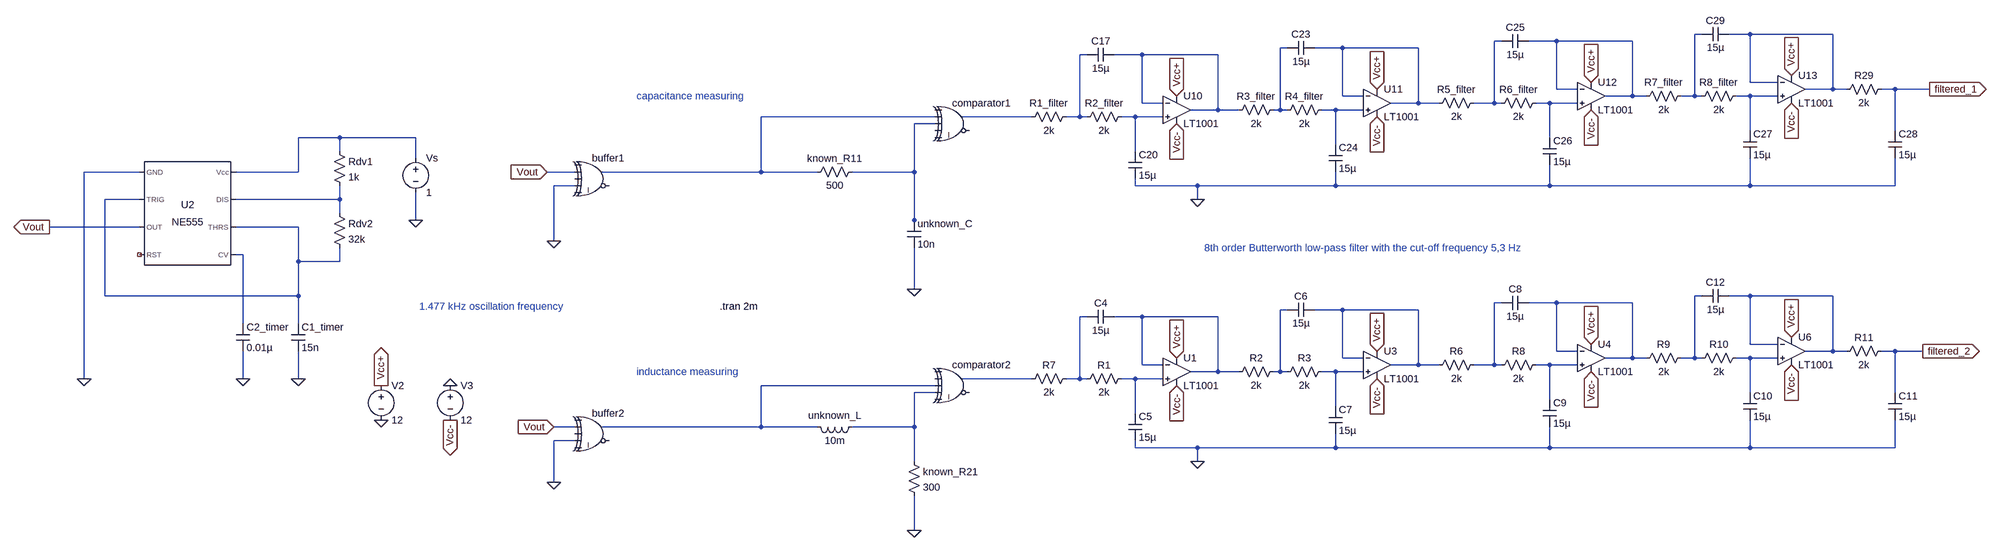
[diagram p0: schematic devre.asc]
devre.asc, the LTspice schematic file:
Version 4
SHEET 1 8244 868
WIRE 5776 -608 5760 -608
WIRE 5888 -608 5840 -608
WIRE 6080 -608 5888 -608
WIRE 5312 -592 5296 -592
WIRE 5440 -592 5376 -592
WIRE 5616 -592 5440 -592
WIRE 4816 -576 4800 -576
WIRE 4944 -576 4880 -576
WIRE 5120 -576 4944 -576
WIRE 4352 -560 4336 -560
WIRE 4480 -560 4416 -560
WIRE 4656 -560 4480 -560
WIRE 5888 -496 5888 -608
WIRE 5952 -496 5888 -496
WIRE 5440 -480 5440 -592
WIRE 5488 -480 5440 -480
WIRE 6080 -480 6080 -608
WIRE 6080 -480 6016 -480
WIRE 6112 -480 6080 -480
WIRE 6224 -480 6192 -480
WIRE 6304 -480 6224 -480
WIRE 4944 -464 4944 -576
WIRE 4992 -464 4944 -464
WIRE 5616 -464 5616 -592
WIRE 5616 -464 5552 -464
WIRE 5648 -464 5616 -464
WIRE 5760 -464 5760 -608
WIRE 5760 -464 5728 -464
WIRE 5776 -464 5760 -464
WIRE 5888 -464 5856 -464
WIRE 5952 -464 5888 -464
WIRE 4480 -448 4480 -560
WIRE 4528 -448 4480 -448
WIRE 5120 -448 5120 -576
WIRE 5120 -448 5056 -448
WIRE 5168 -448 5120 -448
WIRE 5296 -448 5296 -592
WIRE 5296 -448 5248 -448
WIRE 5312 -448 5296 -448
WIRE 5424 -448 5392 -448
WIRE 5488 -448 5424 -448
WIRE 4656 -432 4656 -560
WIRE 4656 -432 4592 -432
WIRE 4704 -432 4656 -432
WIRE 4800 -432 4800 -576
WIRE 4800 -432 4784 -432
WIRE 4816 -432 4800 -432
WIRE 4928 -432 4896 -432
WIRE 4992 -432 4928 -432
WIRE 4000 -416 3584 -416
WIRE 4224 -416 4064 -416
WIRE 4336 -416 4336 -560
WIRE 4336 -416 4304 -416
WIRE 4352 -416 4336 -416
WIRE 4464 -416 4432 -416
WIRE 4528 -416 4464 -416
WIRE 4000 -400 3952 -400
WIRE 5888 -384 5888 -464
WIRE 6224 -384 6224 -480
WIRE 2608 -368 2512 -368
WIRE 2784 -368 2608 -368
WIRE 5424 -368 5424 -448
WIRE 4928 -352 4928 -432
WIRE 2608 -336 2608 -368
WIRE 4464 -336 4464 -416
WIRE 2784 -320 2784 -368
WIRE 2144 -288 2016 -288
WIRE 2512 -288 2512 -368
WIRE 2512 -288 2368 -288
WIRE 3152 -288 3088 -288
WIRE 3584 -288 3584 -416
WIRE 3584 -288 3216 -288
WIRE 3728 -288 3584 -288
WIRE 3952 -288 3952 -400
WIRE 3952 -288 3808 -288
WIRE 3152 -256 3104 -256
WIRE 4464 -256 4464 -272
WIRE 4608 -256 4464 -256
WIRE 4928 -256 4928 -288
WIRE 4928 -256 4608 -256
WIRE 5424 -256 5424 -304
WIRE 5424 -256 4928 -256
WIRE 5888 -256 5888 -320
WIRE 5888 -256 5424 -256
WIRE 6224 -256 6224 -320
WIRE 6224 -256 5888 -256
WIRE 2144 -224 2064 -224
WIRE 2608 -224 2608 -256
WIRE 2608 -224 2368 -224
WIRE 4608 -224 4608 -256
WIRE 2608 -192 2608 -224
WIRE 2784 -176 2784 -240
WIRE 3952 -176 3952 -288
WIRE 2144 -160 1936 -160
WIRE 2512 -160 2368 -160
WIRE 3952 -160 3952 -176
WIRE 3104 -128 3104 -256
WIRE 2384 -96 2368 -96
WIRE 2512 -80 2512 -160
WIRE 2608 -80 2608 -112
WIRE 2608 -80 2512 -80
WIRE 3952 -16 3952 -112
WIRE 2064 0 2064 -224
WIRE 2512 0 2512 -80
WIRE 2512 0 2064 0
WIRE 5776 0 5760 0
WIRE 5888 0 5840 0
WIRE 6080 0 5888 0
WIRE 5312 16 5296 16
WIRE 5440 16 5376 16
WIRE 5616 16 5440 16
WIRE 4816 32 4800 32
WIRE 4944 32 4880 32
WIRE 5120 32 4944 32
WIRE 4352 48 4336 48
WIRE 4480 48 4416 48
WIRE 4656 48 4480 48
WIRE 2384 64 2384 -96
WIRE 2512 64 2512 0
WIRE 5888 112 5888 0
WIRE 5952 112 5888 112
WIRE 5440 128 5440 16
WIRE 5488 128 5440 128
WIRE 6080 128 6080 0
WIRE 6080 128 6016 128
WIRE 6112 128 6080 128
WIRE 6224 128 6192 128
WIRE 6288 128 6224 128
WIRE 4944 144 4944 32
WIRE 4992 144 4944 144
WIRE 5616 144 5616 16
WIRE 5616 144 5552 144
WIRE 5648 144 5616 144
WIRE 5760 144 5760 0
WIRE 5760 144 5728 144
WIRE 5776 144 5760 144
WIRE 5888 144 5856 144
WIRE 5952 144 5888 144
WIRE 4480 160 4480 48
WIRE 4528 160 4480 160
WIRE 5120 160 5120 32
WIRE 5120 160 5056 160
WIRE 5168 160 5120 160
WIRE 5296 160 5296 16
WIRE 5296 160 5248 160
WIRE 5312 160 5296 160
WIRE 5424 160 5392 160
WIRE 5488 160 5424 160
WIRE 4656 176 4656 48
WIRE 4656 176 4592 176
WIRE 4704 176 4656 176
WIRE 4800 176 4800 32
WIRE 4800 176 4784 176
WIRE 4816 176 4800 176
WIRE 4928 176 4896 176
WIRE 4992 176 4928 176
WIRE 2016 192 2016 -288
WIRE 2384 192 2384 128
WIRE 2512 192 2512 128
WIRE 4224 192 4064 192
WIRE 4336 192 4336 48
WIRE 4336 192 4304 192
WIRE 4352 192 4336 192
WIRE 4464 192 4432 192
WIRE 4528 192 4464 192
WIRE 4000 208 3584 208
WIRE 4000 224 3952 224
WIRE 5888 224 5888 144
WIRE 6224 224 6224 128
WIRE 5424 240 5424 160
WIRE 4928 256 4928 176
WIRE 4464 272 4464 192
WIRE 3152 304 3104 304
WIRE 3584 304 3584 208
WIRE 3584 304 3216 304
WIRE 3728 304 3584 304
WIRE 3952 304 3952 224
WIRE 3952 304 3808 304
WIRE 3152 336 3104 336
WIRE 4464 352 4464 336
WIRE 4608 352 4464 352
WIRE 4928 352 4928 320
WIRE 4928 352 4608 352
WIRE 5424 352 5424 304
WIRE 5424 352 4928 352
WIRE 5888 352 5888 288
WIRE 5888 352 5424 352
WIRE 6224 352 6224 288
WIRE 6224 352 5888 352
WIRE 3952 384 3952 304
WIRE 4608 384 4608 352
WIRE 3104 432 3104 336
WIRE 3952 544 3952 464
FLAG 2512 192 0
FLAG 2784 -176 0
FLAG 2384 192 0
FLAG 2016 192 0
FLAG 3952 -16 0
FLAG 3104 -128 0
FLAG 3104 432 0
FLAG 3952 544 0
FLAG 2704 288 0
FLAG 2864 208 0
FLAG 1936 -160 Vout
IOPIN 1936 -160 Out
FLAG 3088 -288 Vout
IOPIN 3088 -288 In
FLAG 3104 304 Vout
IOPIN 3104 304 In
FLAG 2704 208 Vcc+
IOPIN 2704 208 Out
FLAG 2864 288 Vcc-
IOPIN 2864 288 Out
FLAG 4608 384 0
FLAG 4560 208 Vcc-
IOPIN 4560 208 In
FLAG 5024 192 Vcc-
IOPIN 5024 192 In
FLAG 4560 144 Vcc+
IOPIN 4560 144 In
FLAG 5024 128 Vcc+
IOPIN 5024 128 In
FLAG 5520 176 Vcc-
IOPIN 5520 176 In
FLAG 5520 112 Vcc+
IOPIN 5520 112 In
FLAG 5984 160 Vcc-
IOPIN 5984 160 In
FLAG 5984 96 Vcc+
IOPIN 5984 96 In
FLAG 6288 128 filtered_2
IOPIN 6288 128 Out
FLAG 4608 -224 0
FLAG 4560 -400 Vcc-
IOPIN 4560 -400 In
FLAG 5024 -416 Vcc-
IOPIN 5024 -416 In
FLAG 4560 -464 Vcc+
IOPIN 4560 -464 In
FLAG 5024 -480 Vcc+
IOPIN 5024 -480 In
FLAG 5520 -432 Vcc-
IOPIN 5520 -432 In
FLAG 5520 -496 Vcc+
IOPIN 5520 -496 In
FLAG 5984 -448 Vcc-
IOPIN 5984 -448 In
FLAG 5984 -512 Vcc+
IOPIN 5984 -512 In
FLAG 6304 -480 filtered_1
IOPIN 6304 -480 Out
SYMBOL Misc\\NE555 2256 -192 R0
SYMATTR InstName U2
SYMBOL cap 2496 64 R0
SYMATTR InstName C1_timer
SYMATTR Value 15n
SYMBOL res 2592 -352 R0
SYMATTR InstName Rdv1
SYMATTR Value 1k
SYMBOL res 2592 -208 R0
SYMATTR InstName Rdv2
SYMATTR Value 32k
SYMBOL voltage 2784 -336 R0
WINDOW 123 0 0 Left 0
WINDOW 39 0 0 Left 0
SYMATTR InstName Vs
SYMATTR Value 1
SYMBOL cap 2368 64 R0
SYMATTR InstName C2_timer
SYMATTR Value 0.01µ
SYMBOL res 3824 -304 R90
WINDOW 0 0 56 VBottom 2
WINDOW 3 32 56 VTop 2
SYMATTR InstName known_R11
SYMATTR Value 500
SYMBOL cap 3936 -176 R0
SYMATTR InstName unknown_C
SYMATTR Value 10n
SYMBOL Digital\\xor 4048 -464 R0
SYMATTR InstName comparator1
SYMBOL Digital\\xor 3200 -336 R0
SYMATTR InstName buffer1
SYMBOL Digital\\xor 3200 256 R0
SYMATTR InstName buffer2
SYMBOL ind 3824 288 R90
WINDOW 0 5 56 VBottom 2
WINDOW 3 32 56 VTop 2
SYMATTR InstName unknown_L
SYMATTR Value 10m
SYMBOL res 3936 368 R0
SYMATTR InstName known_R21
SYMATTR Value 300
SYMBOL Digital\\xor 4048 144 R0
SYMATTR InstName comparator2
SYMBOL voltage 2704 192 R0
WINDOW 123 0 0 Left 0
WINDOW 39 0 0 Left 0
SYMATTR InstName V2
SYMATTR Value 12
SYMBOL voltage 2864 192 R0
WINDOW 123 0 0 Left 0
WINDOW 39 0 0 Left 0
SYMATTR InstName V3
SYMATTR Value 12
SYMBOL OpAmps\\LT1001 4560 112 R0
SYMATTR InstName U1
SYMBOL cap 4416 32 R90
WINDOW 0 0 32 VBottom 2
WINDOW 3 32 32 VTop 2
SYMATTR InstName C4
SYMATTR Value 15µ
SYMBOL res 4448 176 R90
WINDOW 0 0 56 VBottom 2
WINDOW 3 32 56 VTop 2
SYMATTR InstName R1
SYMATTR Value 2k
SYMBOL cap 4448 272 R0
SYMATTR InstName C5
SYMATTR Value 15µ
SYMBOL res 4800 160 R90
WINDOW 0 0 56 VBottom 2
WINDOW 3 32 56 VTop 2
SYMATTR InstName R2
SYMATTR Value 2k
SYMBOL OpAmps\\LT1001 5024 96 R0
SYMATTR InstName U3
SYMBOL cap 4880 16 R90
WINDOW 0 0 32 VBottom 2
WINDOW 3 32 32 VTop 2
SYMATTR InstName C6
SYMATTR Value 15µ
SYMBOL res 4912 160 R90
WINDOW 0 0 56 VBottom 2
WINDOW 3 32 56 VTop 2
SYMATTR InstName R3
SYMATTR Value 2k
SYMBOL cap 4912 256 R0
SYMATTR InstName C7
SYMATTR Value 15µ
SYMBOL res 5264 144 R90
WINDOW 0 0 56 VBottom 2
WINDOW 3 32 56 VTop 2
SYMATTR InstName R6
SYMATTR Value 2k
SYMBOL res 4320 176 R90
WINDOW 0 0 56 VBottom 2
WINDOW 3 32 56 VTop 2
SYMATTR InstName R7
SYMATTR Value 2k
SYMBOL OpAmps\\LT1001 5520 80 R0
SYMATTR InstName U4
SYMBOL cap 5376 0 R90
WINDOW 0 0 32 VBottom 2
WINDOW 3 32 32 VTop 2
SYMATTR InstName C8
SYMATTR Value 15µ
SYMBOL res 5408 144 R90
WINDOW 0 0 56 VBottom 2
WINDOW 3 32 56 VTop 2
SYMATTR InstName R8
SYMATTR Value 2k
SYMBOL cap 5408 240 R0
SYMATTR InstName C9
SYMATTR Value 15µ
SYMBOL res 5744 128 R90
WINDOW 0 0 56 VBottom 2
WINDOW 3 32 56 VTop 2
SYMATTR InstName R9
SYMATTR Value 2k
SYMBOL OpAmps\\LT1001 5984 64 R0
SYMATTR InstName U6
SYMBOL res 5872 128 R90
WINDOW 0 0 56 VBottom 2
WINDOW 3 32 56 VTop 2
SYMATTR InstName R10
SYMATTR Value 2k
SYMBOL cap 5872 224 R0
SYMATTR InstName C10
SYMATTR Value 15µ
SYMBOL res 6208 112 R90
WINDOW 0 0 56 VBottom 2
WINDOW 3 32 56 VTop 2
SYMATTR InstName R11
SYMATTR Value 2k
SYMBOL cap 6208 224 R0
SYMATTR InstName C11
SYMATTR Value 15µ
SYMBOL cap 5840 -16 R90
WINDOW 0 0 32 VBottom 2
WINDOW 3 32 32 VTop 2
SYMATTR InstName C12
SYMATTR Value 15µ
SYMBOL OpAmps\\LT1001 4560 -496 R0
SYMATTR InstName U10
SYMBOL cap 4416 -576 R90
WINDOW 0 0 32 VBottom 2
WINDOW 3 32 32 VTop 2
SYMATTR InstName C17
SYMATTR Value 15µ
SYMBOL res 4448 -432 R90
WINDOW 0 0 56 VBottom 2
WINDOW 3 32 56 VTop 2
SYMATTR InstName R2_filter
SYMATTR Value 2k
SYMBOL cap 4448 -336 R0
SYMATTR InstName C20
SYMATTR Value 15µ
SYMBOL res 4800 -448 R90
WINDOW 0 0 56 VBottom 2
WINDOW 3 32 56 VTop 2
SYMATTR InstName R3_filter
SYMATTR Value 2k
SYMBOL OpAmps\\LT1001 5024 -512 R0
SYMATTR InstName U11
SYMBOL cap 4880 -592 R90
WINDOW 0 0 32 VBottom 2
WINDOW 3 32 32 VTop 2
SYMATTR InstName C23
SYMATTR Value 15µ
SYMBOL res 4912 -448 R90
WINDOW 0 0 56 VBottom 2
WINDOW 3 32 56 VTop 2
SYMATTR InstName R4_filter
SYMATTR Value 2k
SYMBOL cap 4912 -352 R0
SYMATTR InstName C24
SYMATTR Value 15µ
SYMBOL res 5264 -464 R90
WINDOW 0 0 56 VBottom 2
WINDOW 3 32 56 VTop 2
SYMATTR InstName R5_filter
SYMATTR Value 2k
SYMBOL res 4320 -432 R90
WINDOW 0 0 56 VBottom 2
WINDOW 3 32 56 VTop 2
SYMATTR InstName R1_filter
SYMATTR Value 2k
SYMBOL OpAmps\\LT1001 5520 -528 R0
SYMATTR InstName U12
SYMBOL cap 5376 -608 R90
WINDOW 0 0 32 VBottom 2
WINDOW 3 32 32 VTop 2
SYMATTR InstName C25
SYMATTR Value 15µ
SYMBOL res 5408 -464 R90
WINDOW 0 0 56 VBottom 2
WINDOW 3 32 56 VTop 2
SYMATTR InstName R6_filter
SYMATTR Value 2k
SYMBOL cap 5408 -368 R0
SYMATTR InstName C26
SYMATTR Value 15µ
SYMBOL res 5744 -480 R90
WINDOW 0 0 56 VBottom 2
WINDOW 3 32 56 VTop 2
SYMATTR InstName R7_filter
SYMATTR Value 2k
SYMBOL OpAmps\\LT1001 5984 -544 R0
SYMATTR InstName U13
SYMBOL res 5872 -480 R90
WINDOW 0 0 56 VBottom 2
WINDOW 3 32 56 VTop 2
SYMATTR InstName R8_filter
SYMATTR Value 2k
SYMBOL cap 5872 -384 R0
SYMATTR InstName C27
SYMATTR Value 15µ
SYMBOL res 6208 -496 R90
WINDOW 0 0 56 VBottom 2
WINDOW 3 32 56 VTop 2
SYMATTR InstName R29
SYMATTR Value 2k
SYMBOL cap 6208 -384 R0
SYMATTR InstName C28
SYMATTR Value 15µ
SYMBOL cap 5840 -624 R90
WINDOW 0 0 32 VBottom 2
WINDOW 3 32 32 VTop 2
SYMATTR InstName C29
SYMATTR Value 15µ
TEXT 3488 24 Left 2 !.tran 2m
TEXT 3296 -464 Left 2 ;capacitance measuring
TEXT 3296 176 Left 2 ;inductance measuring
TEXT 4624 -112 Left 2 ;8th order Butterworth low-pass filter with the cut-off frequency 5,3 Hz
TEXT 2792 24 Left 2 ;1.477 kHz oscillation frequency

The netlist it stands for:
* devre.asc
XU2 0 N017 Vout NC_01 N019 N017 N018 N016 NE555  ; pins GND TRIG OUT RST CV THRS DIS Vcc
C1_timer N017 0 15n
Rdv1 N016 N018 1k
Rdv2 N018 N017 32k
Vs N016 0 1
C2_timer N019 0 0.01µ
R§known_R11 N015 N012 500
C§unknown_C N015 0 10n
A§comparator1 0 N012 N015 0 0 0 N013 0 XOR
A§buffer1 0 Vout 0 0 0 0 N012 0 XOR
A§buffer2 0 Vout 0 0 0 0 N033 0 XOR
L§unknown_L N034 N033 10m
R§known_R21 N034 0 300
A§comparator2 0 0 N033 N034 0 0 N031 0 XOR
V2 Vcc+ 0 12
V3 0 Vcc- 12
XU1 N032 N027 Vcc+ Vcc- N027 LT1001  ; pins In+ In- V+ V- OUT
C4 N027 N026 15µ
R1 N032 N026 2k
C5 N032 0 15µ
R2 N024 N027 2k
XU3 N030 N025 Vcc+ Vcc- N025 LT1001  ; pins In+ In- V+ V- OUT
C6 N025 N024 15µ
R3 N030 N024 2k
C7 N030 0 15µ
R6 N022 N025 2k
R7 N026 N031 2k
XU4 N029 N023 Vcc+ Vcc- N023 LT1001  ; pins In+ In- V+ V- OUT
C8 N023 N022 15µ
R8 N029 N022 2k
C9 N029 0 15µ
R9 N020 N023 2k
XU6 N028 N021 Vcc+ Vcc- N021 LT1001  ; pins In+ In- V+ V- OUT
R10 N028 N020 2k
C10 N028 0 15µ
R11 filtered_2 N021 2k
C11 filtered_2 0 15µ
C12 N021 N020 15µ
XU10 N014 N008 Vcc+ Vcc- N008 LT1001  ; pins In+ In- V+ V- OUT
C17 N008 N007 15µ
R2_filter N014 N007 2k
C20 N014 0 15µ
R3_filter N005 N008 2k
XU11 N011 N006 Vcc+ Vcc- N006 LT1001  ; pins In+ In- V+ V- OUT
C23 N006 N005 15µ
R4_filter N011 N005 2k
C24 N011 0 15µ
R5_filter N003 N006 2k
R1_filter N007 N013 2k
XU12 N010 N004 Vcc+ Vcc- N004 LT1001  ; pins In+ In- V+ V- OUT
C25 N004 N003 15µ
R6_filter N010 N003 2k
C26 N010 0 15µ
R7_filter N001 N004 2k
XU13 N009 N002 Vcc+ Vcc- N002 LT1001  ; pins In+ In- V+ V- OUT
R8_filter N009 N001 2k
C27 N009 0 15µ
R29 filtered_1 N002 2k
C28 filtered_1 0 15µ
C29 N002 N001 15µ
.tran 2m
* capacitance measuring
* inductance measuring
* 8th order Butterworth low-pass filter with the cut-off frequency 5,3 Hz
* 1.477 kHz oscillation frequency
.lib NE555.sub
.lib LTC.lib
.backanno
.end